# Altium schematic sheet NUCLEOG431RB-Custom-IN-A2212.SchDoc: NUCLEOG431-Custom
size 297 x 209 mm; Date: 8/26/2200; Author: Rahul; CompanyName: RVCE; DrawnBy: Rahul; Engineer: Rahul; Organization: RVCE; SheetNumber: 1; ENG_APP_DATE: --/--/--; DSN_APP_DATE: --/--/--; CHK_APP_DATE: --/--/--
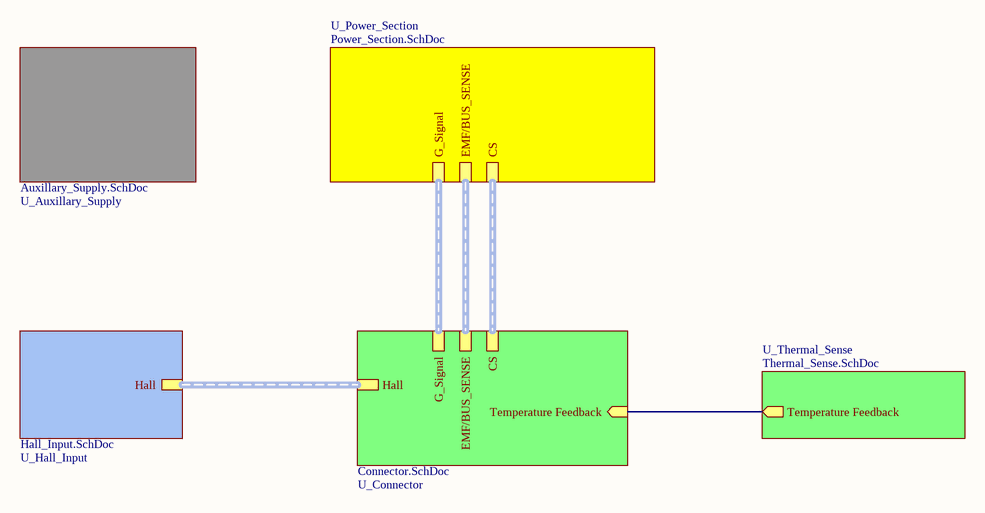
[diagram p0: NUCLEOG431RB-Custom-IN-A2212.SchDoc]

## Sub-sheets
U_Auxillary_Supply = Auxillary_Supply.SchDoc: no entries
U_Connector = Connector.SchDoc: CS (harness CS), G_Signal (harness G_Signal), Temperature Feedback (in), Hall (harness Hall), EMF/BUS_SENSE (harness EMF/BUS_SENSE)
U_Hall_Input = Hall_Input.SchDoc: Hall (harness Hall)
U_Power_Section = Power_Section.SchDoc: G_Signal (harness G_Signal), CS (harness CS), EMF/BUS_SENSE (harness EMF/BUS_SENSE)
U_Thermal_Sense = Thermal_Sense.SchDoc: Temperature Feedback (out)

## Nets
(unnamed): sheet U_Connector/Temperature Feedback, sheet U_Thermal_Sense/Temperature Feedback

## Buses and harness runs
harness sheet U_Connector/CS = sheet U_Power_Section/CS
harness sheet U_Connector/EMF/BUS_SENSE = sheet U_Power_Section/EMF/BUS_SENSE
harness sheet U_Connector/G_Signal = sheet U_Power_Section/G_Signal
harness sheet U_Connector/Hall = sheet U_Hall_Input/Hall

## Notes on the sheet
- Title
- Size:
- Date:
- A3
- Number:
- Time:
- Revision:
- Sheet
- of
- File: